# Altium project PCB_Project1.PrjPCB
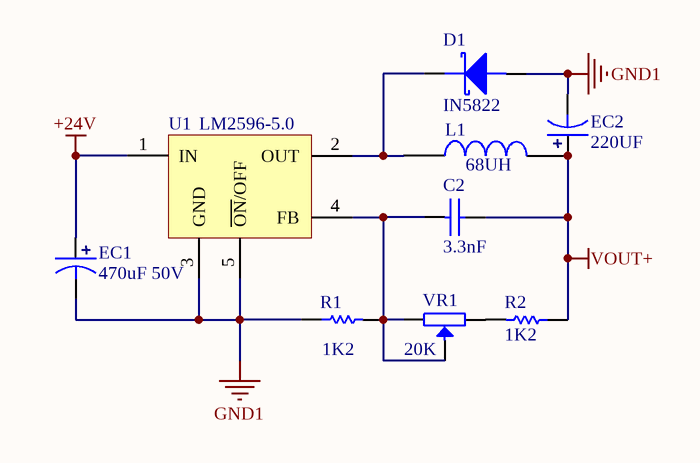
[diagram p0: Sheet1.SchDoc]
1 sheet, 9 parts. Net scope: global (net labels, ports and power ports of the same name join across sheets).
Board file: PCB1.PcbDoc

## Sheet Sheet1.SchDoc
size A4

### Parts
C2  3.3nF  [0805C]
D1  IN5822  [SMA/DO-214AC]
EC1  470uF 50V  [DIP-EC5.0X10X12.5]
EC2  220UF  [DIP-EC5.0X10X16]
L1  68UH  [CDRH124]
R1  1K2  [0805R]
R2  1K2  [0805R]
U1  LM2596-5.0  [TO263-5A]
VR1  20K  [3296W]

### Nets
+24V: EC1.1 U1.1(IN)
GND1: D1.A EC1.2 EC2.2 R1.1 U1.3(GND) U1.5(~{ON}/OFF)
VOUT+: C2.2 EC2.1 L1.2 R2.1
NetC2_1: C2.1 R1.2 U1.4(FB) VR1.2 VR1.3
NetD1_K: D1.K L1.1 U1.2(OUT)
NetR2_2: R2.2 VR1.1

### Library data of the parts
C2 = CAP: 无极性电容
D1 = DIODE SCHOTTKY: 肖特基二极管
EC1 EC2 = DIP_ECAP: 直插电解电容
L1 = INDUCTOR
R1 R2 = RES
U1 = LM2596-5.0: DC降压芯片
VR1 = RESVR